# EAGLE design ATMegaTestingBoard (EAGLE 9.1.0)
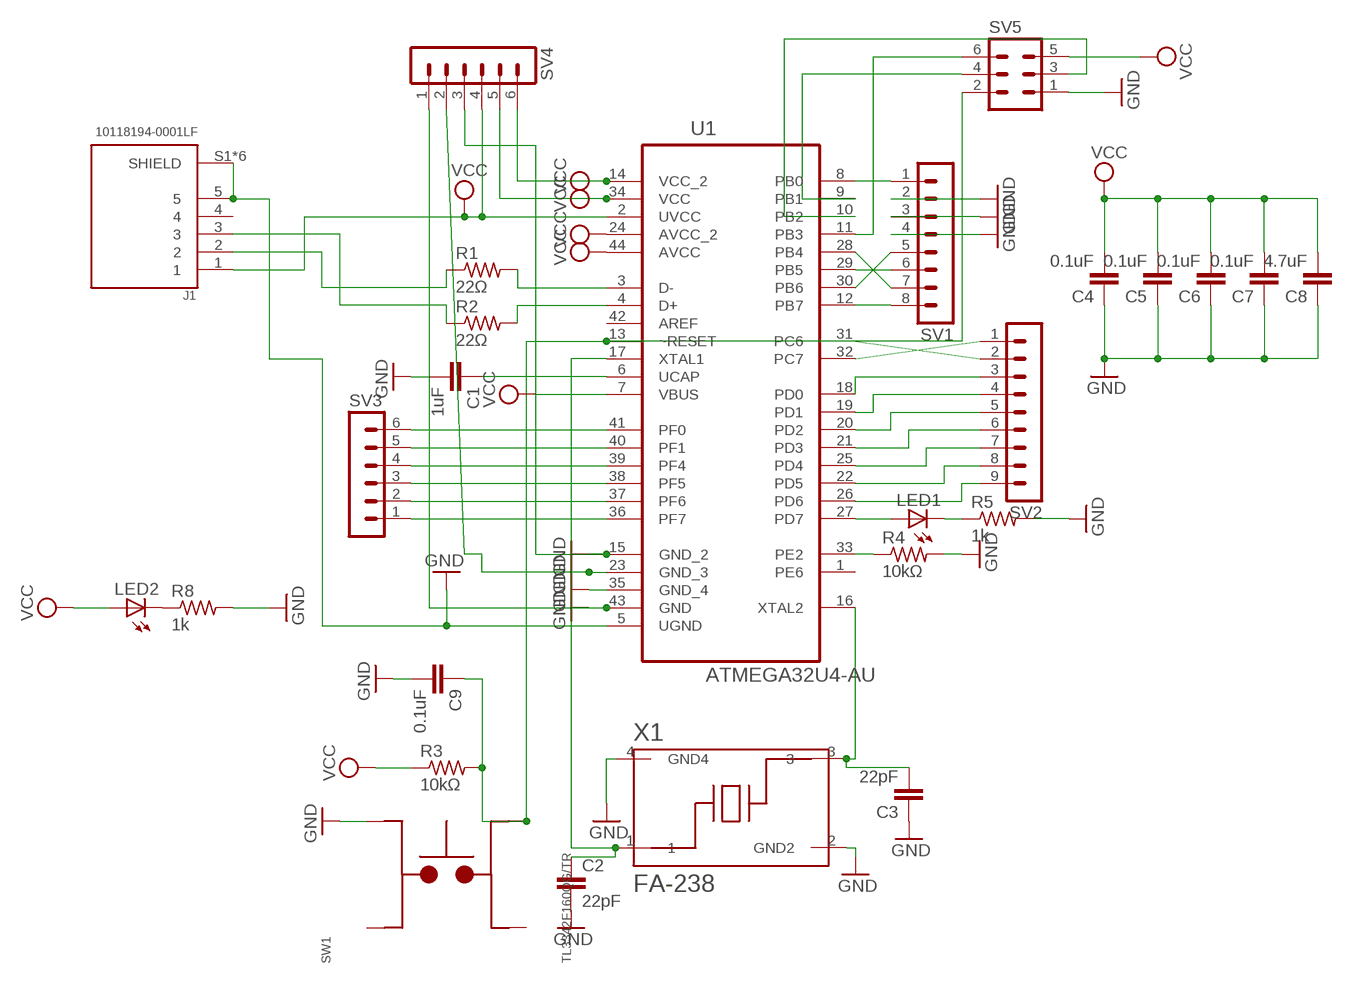
[diagram p0: schematic, sheet 1]

## Parts
C1  1uF  C-EUC0805  [C0805]
C2  22pF  C-EUC0805  [C0805]
C3  22pF  C-EUC0805  [C0805]
C4  0.1uF  C-EUC0805  [C0805]
C5  0.1uF  C-EUC0805  [C0805]
C6  0.1uF  C-EUC0805  [C0805]
C7  0.1uF  C-EUC0805  [C0805]
C8  4.7uF  C-EUC0805  [C0805]
C9  0.1uF  C-EUC0805  [C0805]
J1  10118194-0001LF  [AMPHENOL_10118194-0001LF]
LED1  LEDCHIPLED_0805  [CHIPLED_0805]
LED2  LEDCHIPLED_0805  [CHIPLED_0805]
R1  22Ω  R-US_R0805  [R0805]
R2  22Ω  R-US_R0805  [R0805]
R3  10kΩ  R-US_R0805  [R0805]
R4  10kΩ  R-US_R0805  [R0805]
R5  1k  R-US_R0805  [R0805]
R8  1k  R-US_R0805  [R0805]
SV1  MA08-1  [MA08-1]
SV2  MA09-1  [MA09-1]
SV3  MA06-1  [MA06-1]
SV4  MA06-1  [MA06-1]
SV5  MA03-2  [MA03-2]
SW1  TL3342F160QG/TR  [SW_TL3342F160QG/TR]
U1  ATMEGA32U4-AU  [QFP80P1200X1200X120-44N]
X1  FA-238  [OSCCC320X250X70-4N]

## Nets
GND: C1.2 C2.2 C3.1 C4.1 C5.1 C6.1 C7.1 C8.1 C9.2 J1.5 J1.S1(SHIELD) J1.S2(SHIELD) J1.S3(SHIELD) J1.S4(SHIELD) J1.S5(SHIELD) J1.S6(SHIELD) R4.2 R5.2 R8.2 SV1.2 SV1.3 SV1.4 SV4.1 SV4.2 SV4.3 SV5.1 SW1.4 U1.5(UGND) U1.15(GND_2) U1.23(GND_3) U1.35(GND_4) U1.43(GND) X1.2(GND2) X1.4(GND4)
N$1: R1.2 U1.3(D-)
N$2: J1.3 R2.1
N$3: J1.2 R1.1
N$4: C1.1 U1.6(UCAP)
N$5: R2.2 U1.4(D+)
N$6: SV1.1 U1.8(PB0)
N$7: C9.1 R3.2 SV5.2 SW1.2 U1.13(~RESET)
N$8: C2.1 U1.17(XTAL1) X1.1
N$9: R4.1 U1.33(PE2)
N$10: C3.2 U1.16(XTAL2) X1.3
N$11: LED1.A U1.27(PD7)
N$12: LED1.C R5.1
N$13: SV1.7 U1.28(PB4)
N$14: SV1.5 U1.30(PB6)
N$15: LED2.C R8.1
N$16: SV5.6 U1.11(PB3)
N$17: SV5.4 U1.9(PB1)
N$18: SV5.3 U1.10(PB2)
N$19: SV1.6 U1.29(PB5)
N$20: SV2.2 U1.31(PC6)
N$21: SV2.1 U1.32(PC7)
N$22: SV1.8 U1.12(PB7)
N$25: SV2.3 U1.18(PD0)
N$26: SV2.4 U1.19(PD1)
N$27: SV2.5 U1.20(PD2)
N$28: SV2.6 U1.21(PD3)
N$29: SV2.7 U1.25(PD4)
N$30: SV2.8 U1.22(PD5)
N$31: SV2.9 U1.26(PD6)
N$32: SV3.6 U1.41(PF0)
N$33: SV3.5 U1.40(PF1)
N$34: SV3.4 U1.39(PF4)
N$35: SV3.3 U1.38(PF5)
N$36: SV3.2 U1.37(PF6)
N$37: SV3.1 U1.36(PF7)
VCC: C4.2 C5.2 C6.2 C7.2 C8.2 J1.1 LED2.A R3.1 SV4.4 SV4.5 SV4.6 SV5.5 U1.2(UVCC) U1.7(VBUS) U1.14(VCC_2) U1.24(AVCC_2) U1.34(VCC) U1.44(AVCC)
Unconnected: J1.4 SW1.1 SW1.3 U1.1(PE6) U1.42(AREF)

## Library data of the parts
C1-C9 = rcl:C-EU: CAPACITOR, European symbol; SPICEPREFIX: C
J1 = 10118194-0001LF:10118194-0001LF: Micro Usb, 2.0 Type b, Rcpt, Smt; AVAILABILITY: Unavailable; DESCRIPTION: Micro Usb, 2.0 Type b, Rcpt, Smt; MF: Amphenol ICC; MP: 10118194-0001LF; PACKAGE: None; PRICE: None
LED1 LED2 = led:LED: LED OSRAM: - CHIPLED LG R971, LG N971, LY N971, LG Q971, LY Q971, LO R971, LY R971 LH N974, LH R974 LS Q976, LO Q976, LY Q976 LO Q996 - Hyper CHIPLED LW Q18S LB Q993, LB Q99A, LB R99A - SideLED LS A670, LO A670, LY A670, LG A670, LP A670 LB A673, LV A673, LT A673, LW A673 LH A674 LY A675 LS A676, LA A676, LO A676, LY A676, LW A676 LS A679, LY A679, LG A679 - Hyper Micro SIDELED® LS Y876, LA Y876, LO Y876, LY Y876 LT Y87S - SmartLED LW L88C, LW L88S LB L89C, LB L89S, LG L890 LS L89K, LO L89K, LY L89K LS L896, LA L896, LO L896, LY L896 - TOPLED LS T670, LO T670, LY T670, LG T670, LP T670 LSG T670, LSP T670, LSY T670, LOP T670, LYG T670 LG T671, LOG T671, LSG T671 LB T673, LV T673, LT T673, LW T673 LH T674 LS T676, LA T676, LO T676, LY T676, LB T676, LH T676, LSB T676, LW T676 LB T67C, LV T67C, LT T67C, LS T67K, LO T67K, LY T67K, LW E67C LS E67B, LA E67B, LO E67B, LY E67B, LB E67C, LV E67C, LT E67C LW T67C LS T679, LY T679, LG T679 LS T770, LO T770, LY T770, LG T770, LP T770 LB T773, LV T773, LT T773, LW T773 LH T774 LS E675, LA E675, LY E675, LS T675 LS T776, LA T776, LO T776, LY T776, LB T776 LHGB T686 LT T68C, LB T68C - Hyper Mini TOPLED® LB M676 - Mini TOPLED Santana® LG M470 LS M47K, LO M47K, LY M47K Source: http://www.osram.convergy.de LUXEON: - LUMILED® LXK2-PW12-R00, LXK2-PW12-S00, LXK2-PW14-U00, LXK2-PW14-V00 LXK2-PM12-R00, LXK2-PM12-S00, LXK2-PM14-U00 LXK2-PE12-Q00, LXK2-PE12-R00, LXK2-PE12-S00, LXK2-PE14-T00, LXK2-PE14-U00 LXK2-PB12-K00, LXK2-PB12-L00, LXK2-PB12-M00, LXK2-PB14-N00, LXK2-PB14-P00, LXK2-PB14-Q00 LXK2-PR12-L00, LXK2-PR12-M00, LXK2-PR14-Q00, LXK2-PR14-R00 LXK2-PD12-Q00, LXK2-PD12-R00, LXK2-PD12-S00 LXK2-PH12-R00, LXK2-PH12-S00 LXK2-PL12-P00, LXK2-PL12-Q00, LXK2-PL12-R00 Source: www.luxeon.com KINGBRIGHT: KA-3528ASYC Source: www.kingbright.com
R1-R5 R8 = rcl:R-US_: RESISTOR, American symbol; SPICEPREFIX: R
SV1 = con-lstb:MA08-1: PIN HEADER; OC_FARNELL: unknown; OC_NEWARK: unknown
SV2 = con-lstb:MA09-1: PIN HEADER; OC_FARNELL: unknown; OC_NEWARK: unknown
SV3 SV4 = con-lstb:MA06-1: PIN HEADER; OC_FARNELL: unknown; OC_NEWARK: unknown
SV5 = con-lstb:MA03-2: PIN HEADER; OC_FARNELL: unknown; OC_NEWARK: unknown
SW1 = TL3342F160QG_TR:TL3342F160QG/TR: TL3342 Series SPST 1.6 N Round Button Gull Wing Surface Mount Tactile Switch; DESCRIPTION: Switch Tactile Spst-No 0.05a 12v; DIGI-KEY_PART_NUMBER: EG2531CT-ND; DIGI-KEY_PURCHASE_URL: https://www.digikey.com/product-detail/en/e-switch/TL3342F160QG-TR/EG2531CT-ND/379004?utm_source=snapeda&utm_medium=aggregator&utm_campaign=symbol; MF: E-Switch; MP: TL3342F160QG/TR; PACKAGE: FakePackage u
U1 = ATMEGA32U4-AU:ATMEGA32U4-AU: 8-bit Microcontroller with ISP Flash and USB Controller; AVAILABILITY: Unavailable; DESCRIPTION: MCU 8-bit ATmega AVR RISC 32KB Flash 3.3V/5V 44-Pin TQFP; MF: Microchip; MP: ATMEGA32U4-AU; PACKAGE: TQFP-44 Microchip; PRICE: None
X1 = FA-238:FA-238: Crystal 24.0000mhz 18pf Smd; AVAILABILITY: Unavailable; MF: EPSON; MP: FA-238; PACKAGE: SMD-4 Epson; PRICE: None

## Board
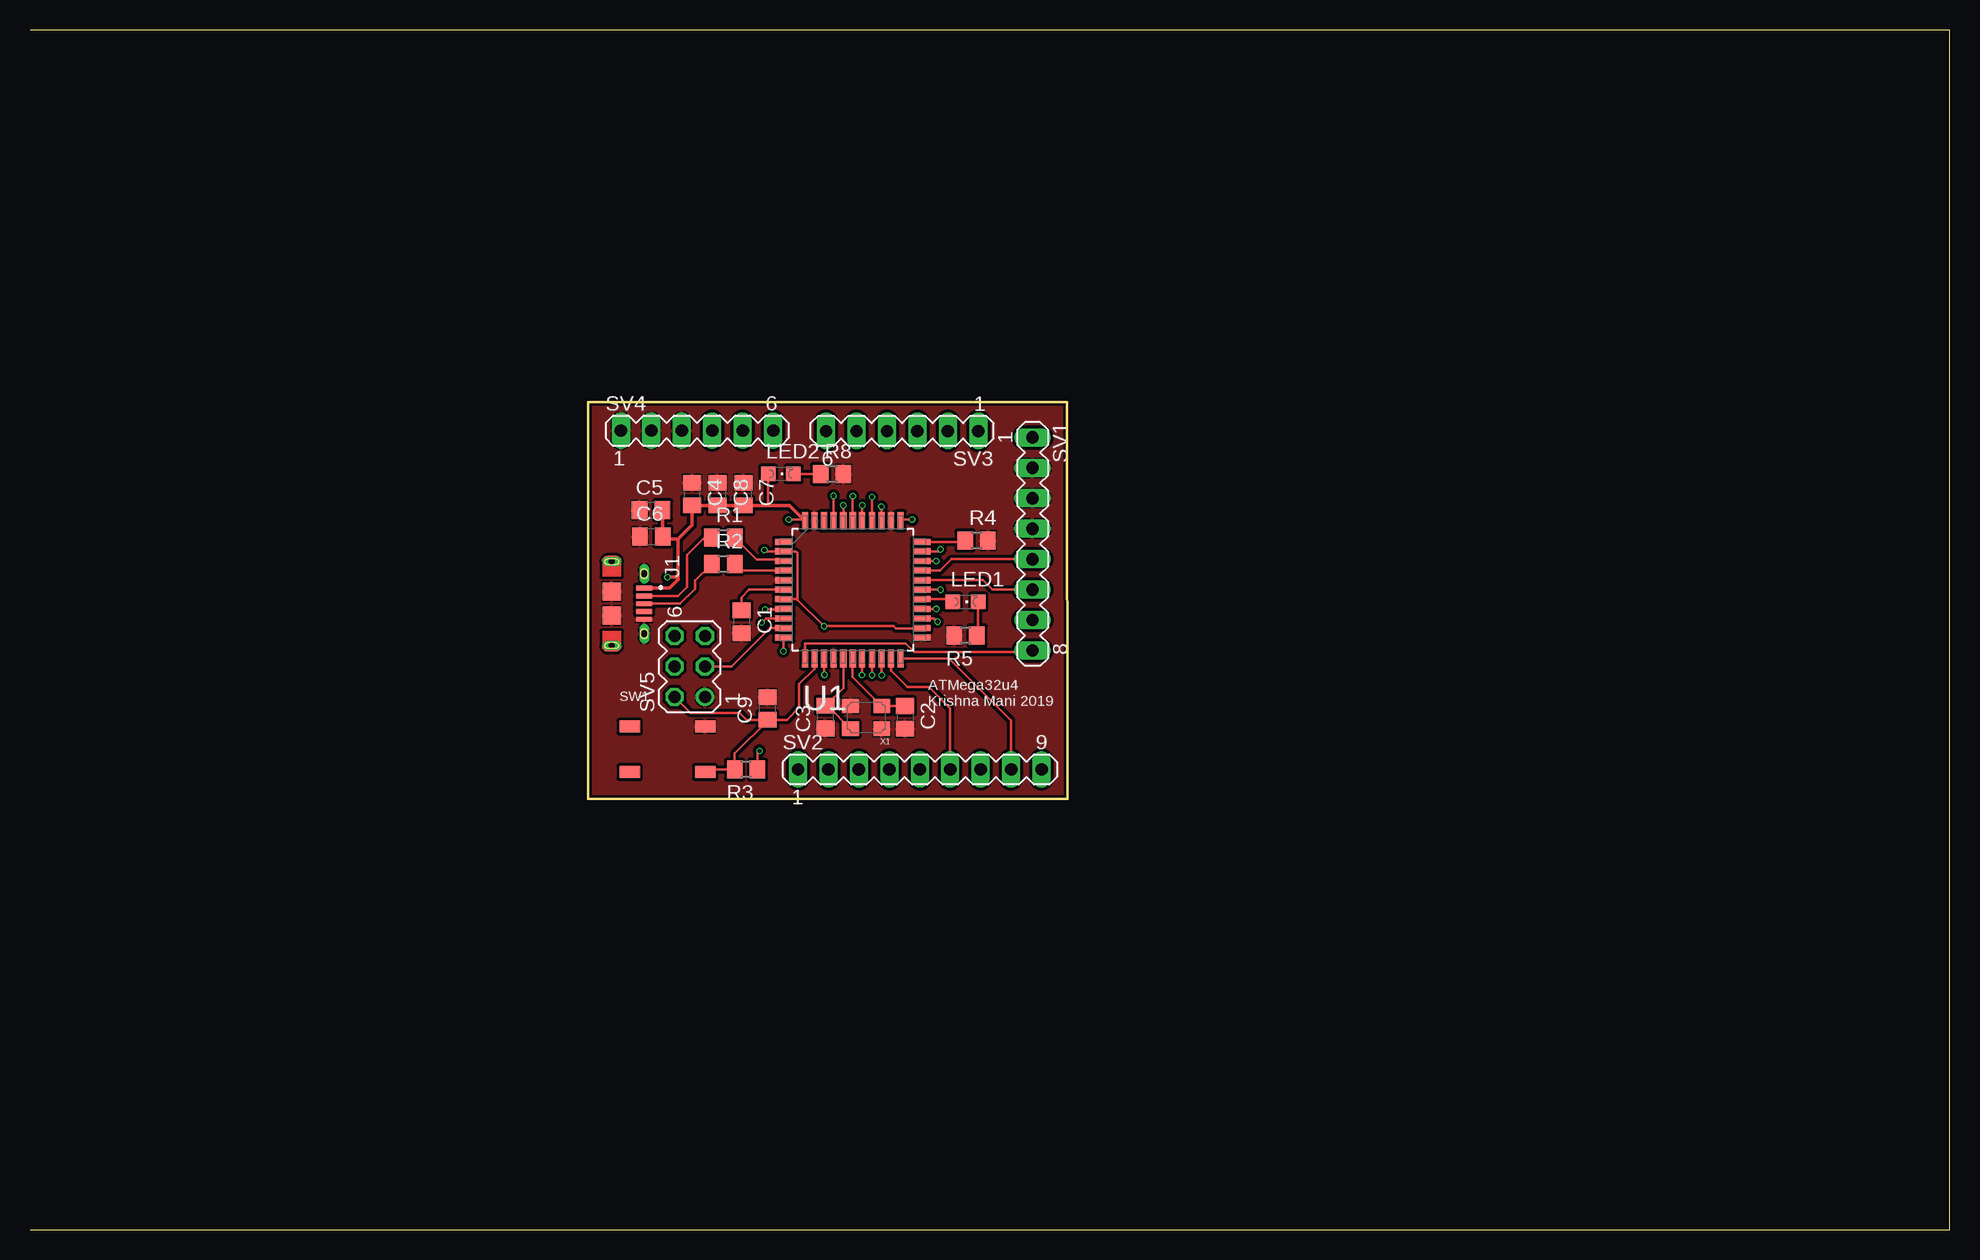
[diagram p1: board, top side]
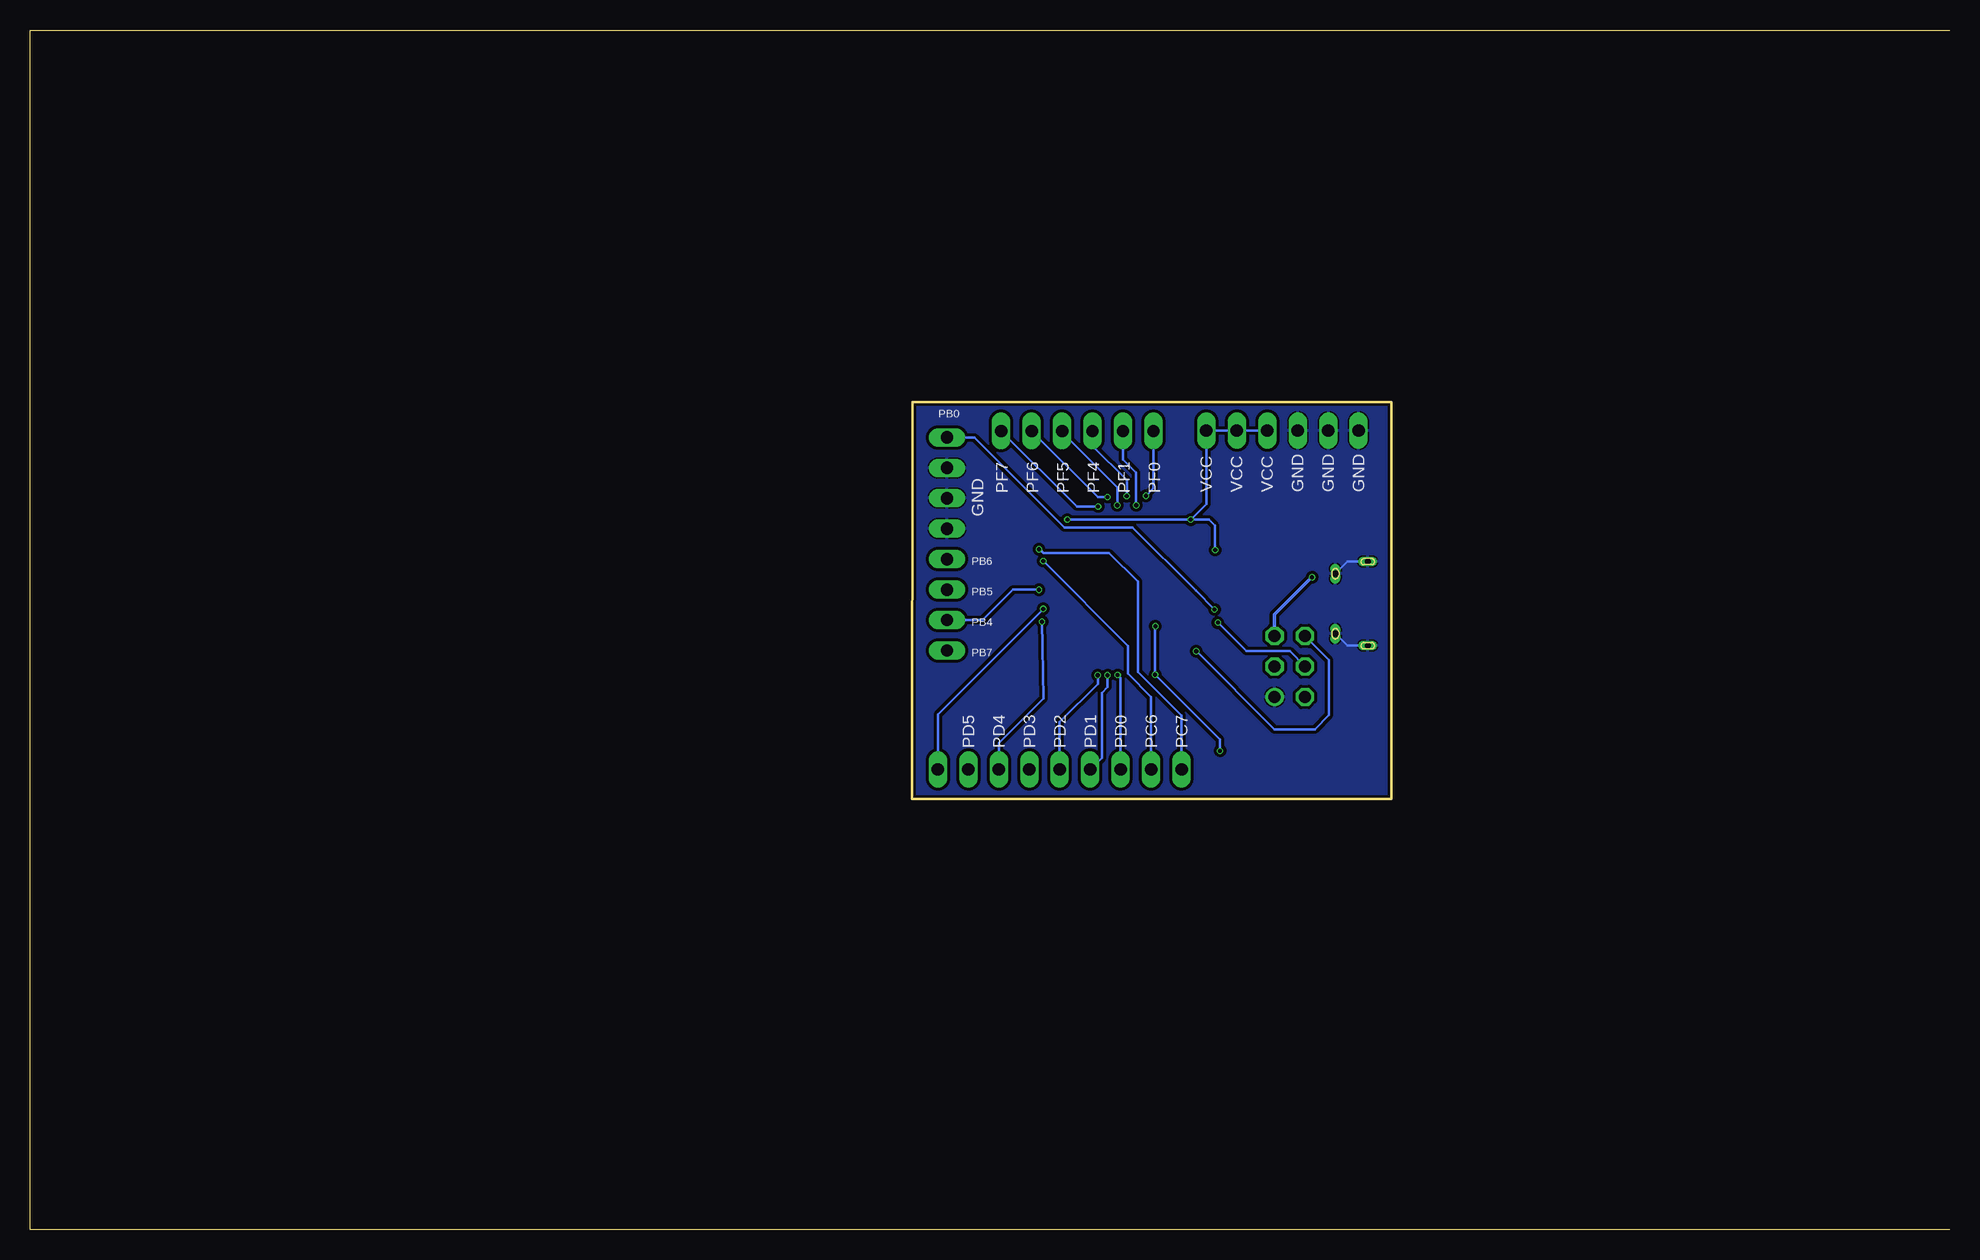
[diagram p2: board, bottom side, seen from below]

Size 160 x 100 mm. Coordinates in mm from the lower left corner, seen from the top.
Outline: 0,0 160,0 160,100 0,100
Outline: 46.53,35.92 46.51,68.96 86.44,68.96 86.46,35.92 46.53,35.92
Copper layers (1*16): Top 0.035559375mm / dielectric 1.6mm / Bottom 0.035559375mm
Design rules "jlcpcb2layer *": minimum track width 5mil, minimum drill 12mil, track to track 10mil, track to pad 10mil, pad to pad 10mil, via to via 10mil, smd to smd 5mil, copper to edge 8mil, drill to drill 6mil, minimum pad ring 5mil, minimum via ring 3mil, stop-mask expansion 2.5mil, vias tented up to drill 0mil, thermal gap 5mil

### Footprints (pad centres in the part's own frame; a part is rotated, then mirrored left to right if it is on the bottom)
C0805 = smd 1.3 x 1.5: 1 -0.95,0; 2 0.95,0
AMPHENOL_10118194-0001LF = smd 0.4 x 1.35: 1 -1.3,2.7; 2 -0.65,2.7; 3 0,2.7; 4 0.65,2.7; 5 1.3,2.7 | drill 0.55 pad 0.65 long: S1 -2.5,2.7; S2 2.5,2.7 | drill 0.5 pad 0.775 long: S3 -3.5,0; S6 3.5,0 | smd 1.5 x 1.55: S4 -1,0; S5 1,0
CHIPLED_0805 = smd 1.2 x 1.2: A 0,-1.05; C 0,1.05
R0805 = smd 1.3 x 1.5: 1 -0.95,0; 2 0.95,0
MA08-1 = drill 1.016 long: 1 -8.89,0; 2 -6.35,0; 3 -3.81,0; 4 -1.27,0; 5 1.27,0; 6 3.81,0; 7 6.35,0; 8 8.89,0
MA09-1 = drill 1.016 long: 1 -10.16,0; 2 -7.62,0; 3 -5.08,0; 4 -2.54,0; 5 0,0; 6 2.54,0; 7 5.08,0; 8 7.62,0; 9 10.16,0
MA06-1 = drill 1.016 long: 1 -6.35,0; 2 -3.81,0; 3 -1.27,0; 4 1.27,0; 5 3.81,0; 6 6.35,0
MA03-2 = drill 1.016: 1 -2.54,-1.27 | drill 1.016 octagon: 2 -2.54,1.27; 3 0,-1.27; 4 0,1.27; 5 2.54,-1.27; 6 2.54,1.27
SW_TL3342F160QG/TR = smd 1.7 x 1: 1 -3.15,-1.9; 2 3.15,-1.9; 3 -3.15,1.9; 4 3.15,1.9
QFP80P1200X1200X120-44N = smd 1.473 x 0.508: 1 -5.74,3.988; 2 -5.74,3.2; 3 -5.74,2.388; 4 -5.74,1.6; 5 -5.74,0.787; 6 -5.74,0; 7 -5.74,-0.787; 8 -5.74,-1.6; 9 -5.74,-2.388; 10 -5.74,-3.2; 11 -5.74,-3.988; 23 5.74,-3.988; 24 5.74,-3.2; 25 5.74,-2.388; 26 5.74,-1.6; 27 5.74,-0.787; 28 5.74,0; 29 5.74,0.787; 30 5.74,1.6; 31 5.74,2.388; 32 5.74,3.2; 33 5.74,3.988 | smd 0.508 x 1.473: 12 -3.988,-5.74; 13 -3.2,-5.74; 14 -2.388,-5.74; 15 -1.6,-5.74; 16 -0.787,-5.74; 17 0,-5.74; 18 0.787,-5.74; 19 1.6,-5.74; 20 2.388,-5.74; 21 3.2,-5.74; 22 3.988,-5.74; 34 3.988,5.74; 35 3.2,5.74; 36 2.388,5.74; 37 1.6,5.74; 38 0.787,5.74; 39 0,5.74; 40 -0.787,5.74; 41 -1.6,5.74; 42 -2.388,5.74; 43 -3.2,5.74; 44 -3.988,5.74
OSCCC320X250X70-4N = smd 1.4 x 1.2: 1 -1.3,-0.95; 2 1.3,-0.95; 3 1.3,0.95; 4 -1.3,0.95

### Placement (x,y rotation side)
C1  59.31,50.67 270 top
C2  72.92,42.7 270 top
C3  66.32,42.72 90 top
C4  55.17,61.32 270 top
C5  51.77,59.97 0 top
C6  51.79,57.78 0 top
C7  59.46,61.32 270 top
C8  57.33,61.32 270 top
C9  61.47,43.43 90 top
J1  48.49,52.17 270 top
LED1  77.98,52.32 270 top
LED2  62.59,62.99 270 top
R1  57.78,57.68 0 top
R2  57.78,55.5 0 top
R3  59.69,38.35 180 top
R4  78.89,57.45 0 top
R5  77.98,49.53 180 top
R8  66.85,62.99 0 top
SV1  83.57,57.15 270 top
SV2  74.17,38.35 0 top
SV3  72.69,66.57 180 top
SV4  55.6,66.6 0 top
SV5  54.99,46.94 90 top
SW1  53.14,40.03 0 top
U1  68.58,53.34 0 top
X1  69.7,42.7 180 top

### Tracks (layer width: path | path; a pad name or v marks a point on that pad's centre or on a via)
GND
  Bottom 0.203: J1.S6 50.19,48.67 J1.S2 | J1.S3 50.19,55.67 J1.S1
  pour Top: 37.08,71.12 37.08,33.27 38.61,31.75 86.36,31.75 88.39,33.78 88.39,70.61 87.88,71.12
  pour Bottom: 37.34,71.63 37.34,33.78 35.31,31.75 85.09,31.75 86.61,33.27 92.96,39.62 92.96,72.9 38.61,72.9
N$1
  Top 0.203: R1.2 60.58,55.84 62.73,55.84 U1.3
N$2
  Top 0.203: J1.3 54.2,52.17 55.42,53.39 55.42,54.09 R2.1
N$3
  Top 0.203: R1.1 56.24,57.68 54.79,56.24 54.79,53.57 54.04,52.82 J1.2
N$4
  Top 0.203: C1.1 59.31,52.7 59.94,53.34 U1.6
N$5
  Top 0.203: R2.2 59.29,54.94 U1.4
N$6  (via drill 0.35)
  Top 0.203: U1.8 62.79,51.69 v61.27,51.69
  Bottom 0.203: v61.27,51.69 62.83,53.25 68.09,58.51 73.76,58.51 81.29,66.04 SV1.1
N$7
  Top 0.203: U1.13 65.38,46.74 64.11,45.47 64.11,43.51 63.08,42.48 61.54,42.48 | 61.54,42.48 C9.1 59.73,42.48 59.13,43.08 55.04,43.08 SV5.2 | 61.54,42.48 58.74,39.68 R3.2 56.51,38.35 SW1.2
N$8
  Top 0.203: C2.1 X1.1 68.58,46.06 U1.17
N$9
  Top 0.203: U1.33 77.81,57.33 R4.1
N$10
  Top 0.203: U1.16 67.79,45.15 C3.2 66.47,43.67 X1.3
N$11
  Top 0.203: U1.27 76.7,52.55 LED1.A
N$12
  Top 0.203: LED1.C 79.03,49.63 R5.1
N$13  (via drill 0.35)
  Top 0.203: U1.28 v75.89,53.34
  Bottom 0.203: v75.89,53.34 78.08,53.34 80.62,50.8 SV1.7
N$14
  Top 0.203: U1.30 75.87,54.94 76.81,55.88 SV1.5
N$15
  Top 0.203: LED2.C R8.1
N$16  (via drill 0.35)
  Top 0.203: U1.11 62.81,49.33 62.81,48.23 v62.79,48.21
  Bottom 0.203: v62.79,48.21 56.29,41.71 52.91,41.71 51.74,42.88 51.74,47.5 SV5.6
N$17  (via drill 0.35)
  Top 0.203: U1.9 61.34,50.95 v60.98,50.6
  Bottom 0.203: v60.98,50.6 58.6,48.21 54.99,48.21 SV5.4
N$18
  Top 0.203: SV5.3 58.47,46.94 61.67,50.14 U1.10
N$19
  Top 0.203: U1.29 79.45,54.13 80.24,53.34 SV1.6
N$20  (via drill 0.35)
  Top 0.203: U1.31 v75.54,55.73
  Bottom 0.203: v75.54,55.73 68.48,48.67 68.48,46.34 66.55,44.41 SV2.2
N$21  (via drill 0.35)
  Top 0.203: U1.32 75.73,56.54 v75.89,56.71
  Bottom 0.203: SV2.1 64.01,42.85 67.64,46.48 67.64,54 70.05,56.41 75.52,56.41 75.82,56.71 v75.89,56.71
N$22
  Top 0.203: U1.12 64.59,48.87 72.97,48.87 73.71,48.13 76.15,48.13 83.44,48.13 SV1.8
N$25  (via drill 0.35)
  Top 0.203: U1.18 69.37,46.25 v69.34,46.23
  Bottom 0.203: v69.34,46.23 69.09,45.97 SV2.3
N$26  (via drill 0.35)
  Top 0.203: v70.18,46.2 U1.19
  Bottom 0.203: v70.18,46.2 70.18,45.21 70.66,44.73 70.66,39.32 SV2.4
N$27  (via drill 0.35)
  Top 0.203: U1.20 70.97,46.23 v70.99,46.2
  Bottom 0.203: v70.99,46.2 70.99,45.49 74.17,42.32 SV2.5
N$28
  Top 0.203: U1.21 71.78,46.58 73.15,45.21 74.93,45.21 76.71,43.43 SV2.6
N$29  (via drill 0.35)
  Top 0.203: U1.25 75.36,50.95 v75.64,50.67
  Bottom 0.203: v75.64,50.67 75.54,44.27 79.25,40.56 SV2.7
N$30
  Top 0.203: U1.22 76.61,47.6 81.79,42.42 SV2.8
N$31  (via drill 0.35)
  Top 0.203: U1.26 v75.54,51.74
  Bottom 0.203: v75.54,51.74 84.33,42.95 SV2.9
N$32  (via drill 0.35)
  Top 0.203: U1.41 v66.98,61.16
  Bottom 0.203: v66.98,61.16 66.34,61.8 SV3.6
N$33  (via drill 0.35)
  Top 0.203: U1.40 v67.79,60.38
  Bottom 0.203: v67.79,60.38 67.79,63.09 68.89,64.19 SV3.5
N$34  (via drill 0.35)
  Top 0.203: U1.39 v68.58,61.14
  Bottom 0.203: v68.58,61.14 68.58,62.48 71.42,65.33 SV3.4
N$35  (via drill 0.35)
  Top 0.203: U1.38 v69.37,60.38
  Bottom 0.203: SV3.3 73.97,66.47 69.37,61.87 v69.37,60.38
N$36  (via drill 0.35)
  Top 0.203: U1.37 v70.18,61.06
  Bottom 0.203: v70.18,61.06 70.99,61.06 SV3.2
N$37  (via drill 0.35)
  Top 0.203: U1.36 v70.97,60.27
  Bottom 0.203: v70.97,60.27 72.75,60.27 SV3.1
VCC  (via drill 0.35)
  Top 0.203: v61.21,56.64 61.32,56.54 U1.2 63.83,56.54 63.99,56.38 63.99,52.49 | v63.25,59.18 64.49,59.18 U1.44 | v73.53,59.18 72.67,59.18 U1.34 | U1.7 63.93,52.55 63.99,52.49 | 63.99,52.49 v66.19,50.29 71.98,50.29 72.19,50.09 74.27,50.09 U1.24 | v66.22,46.25 66.19,46.28 U1.14 | v60.81,39.9 60.64,39.74 R3.1 | LED2.A 61.54,60.41 61.49,60.37
  Top 0.305: 54,54.38 54,54.18 53.29,53.47 J1.1 | 54,54.38 54,57.56 | 54,57.56 55.17,58.73 C4.2 C8.2 C7.2 61.49,60.37 63.31,60.37 U1.44 | 54,57.56 52.97,57.56 C6.2 52.74,59.94 C5.2 | v53.14,54.38 54,54.38
  Bottom 0.203: v61.21,56.64 61.21,58.67 61.72,59.18 v63.25,59.18 | v63.25,59.18 v73.53,59.18 | SV4.4 SV4.5 SV4.6 61.95,60.48 v63.25,59.18 | v60.81,39.9 60.81,40.84 v66.22,46.25 66.22,50.27 v66.19,50.29
  Bottom 0.305: SV5.5 56.26,51.28 53.16,54.38 v53.14,54.38

### Text on the board
tPlace: ATMega32u4 / Krishna Mani 2019
bPlace: PB0 | PF0 | PF1 | PF4 | PF5 | PF6 | PF7 | GND | GND | GND | VCC | VCC | VCC | GND | PB6 | PB5 | PB4 | PB7 | PD4 | PC7 | PC6 | PD0 | PD1 | PD2 | PD3 | PD5